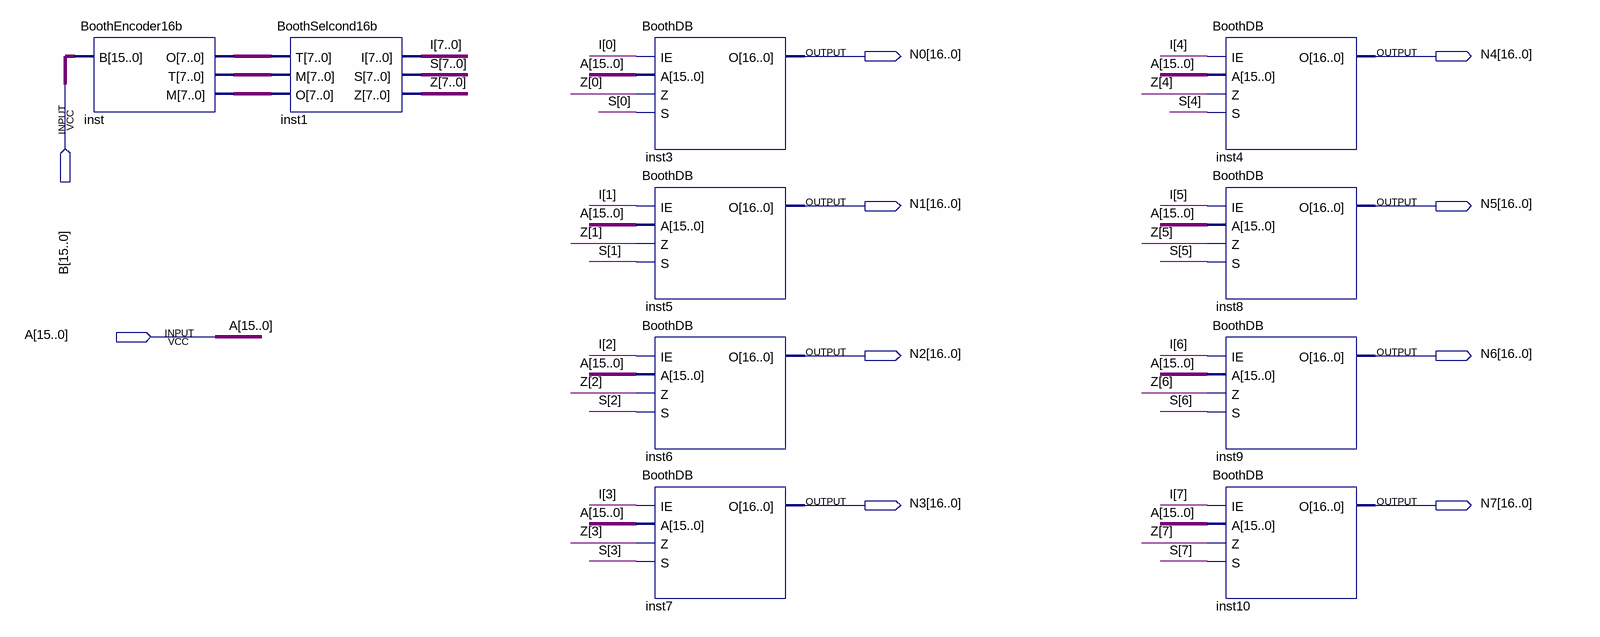
[diagram p0: schematic sheet]
// Quartus schematic BoothSelector16b.bdf as structural Verilog: 10 symbols, 10 pins
module BoothSelector16b (
  input  [15:0] B,
  input  [15:0] A,
  output [16:0] N0,
  output [16:0] N4,
  output [16:0] N1,
  output [16:0] N5,
  output [16:0] N2,
  output [16:0] N6,
  output [16:0] N3,
  output [16:0] N7
);

  wire [7:0] I, inst_m, inst_o, inst_t, S, Z;

  BoothEncoder16b inst (.B(B), .O(inst_o), .T(inst_t), .M(inst_m));
  BoothSelcond16b inst1 (.T(inst_o), .M(inst_t), .O(inst_m), .I(I), .S(S), .Z(Z));
  BoothDB inst3 (.IE(I[0]), .A(A), .Z(Z[0]), .S(S[0]), .O(N0));
  BoothDB inst5 (.IE(I[1]), .A(A), .Z(Z[1]), .S(S[1]), .O(N1));
  BoothDB inst6 (.IE(I[2]), .A(A), .Z(Z[2]), .S(S[2]), .O(N2));
  BoothDB inst7 (.IE(I[3]), .A(A), .Z(Z[3]), .S(S[3]), .O(N3));
  BoothDB inst4 (.IE(I[4]), .A(A), .Z(Z[4]), .S(S[4]), .O(N4));
  BoothDB inst8 (.IE(I[5]), .A(A), .Z(Z[5]), .S(S[5]), .O(N5));
  BoothDB inst9 (.IE(I[6]), .A(A), .Z(Z[6]), .S(S[6]), .O(N6));
  BoothDB inst10 (.IE(I[7]), .A(A), .Z(Z[7]), .S(S[7]), .O(N7));
endmodule
